# EAGLE design ISP_POGO_programmer (EAGLE 7.2.0)
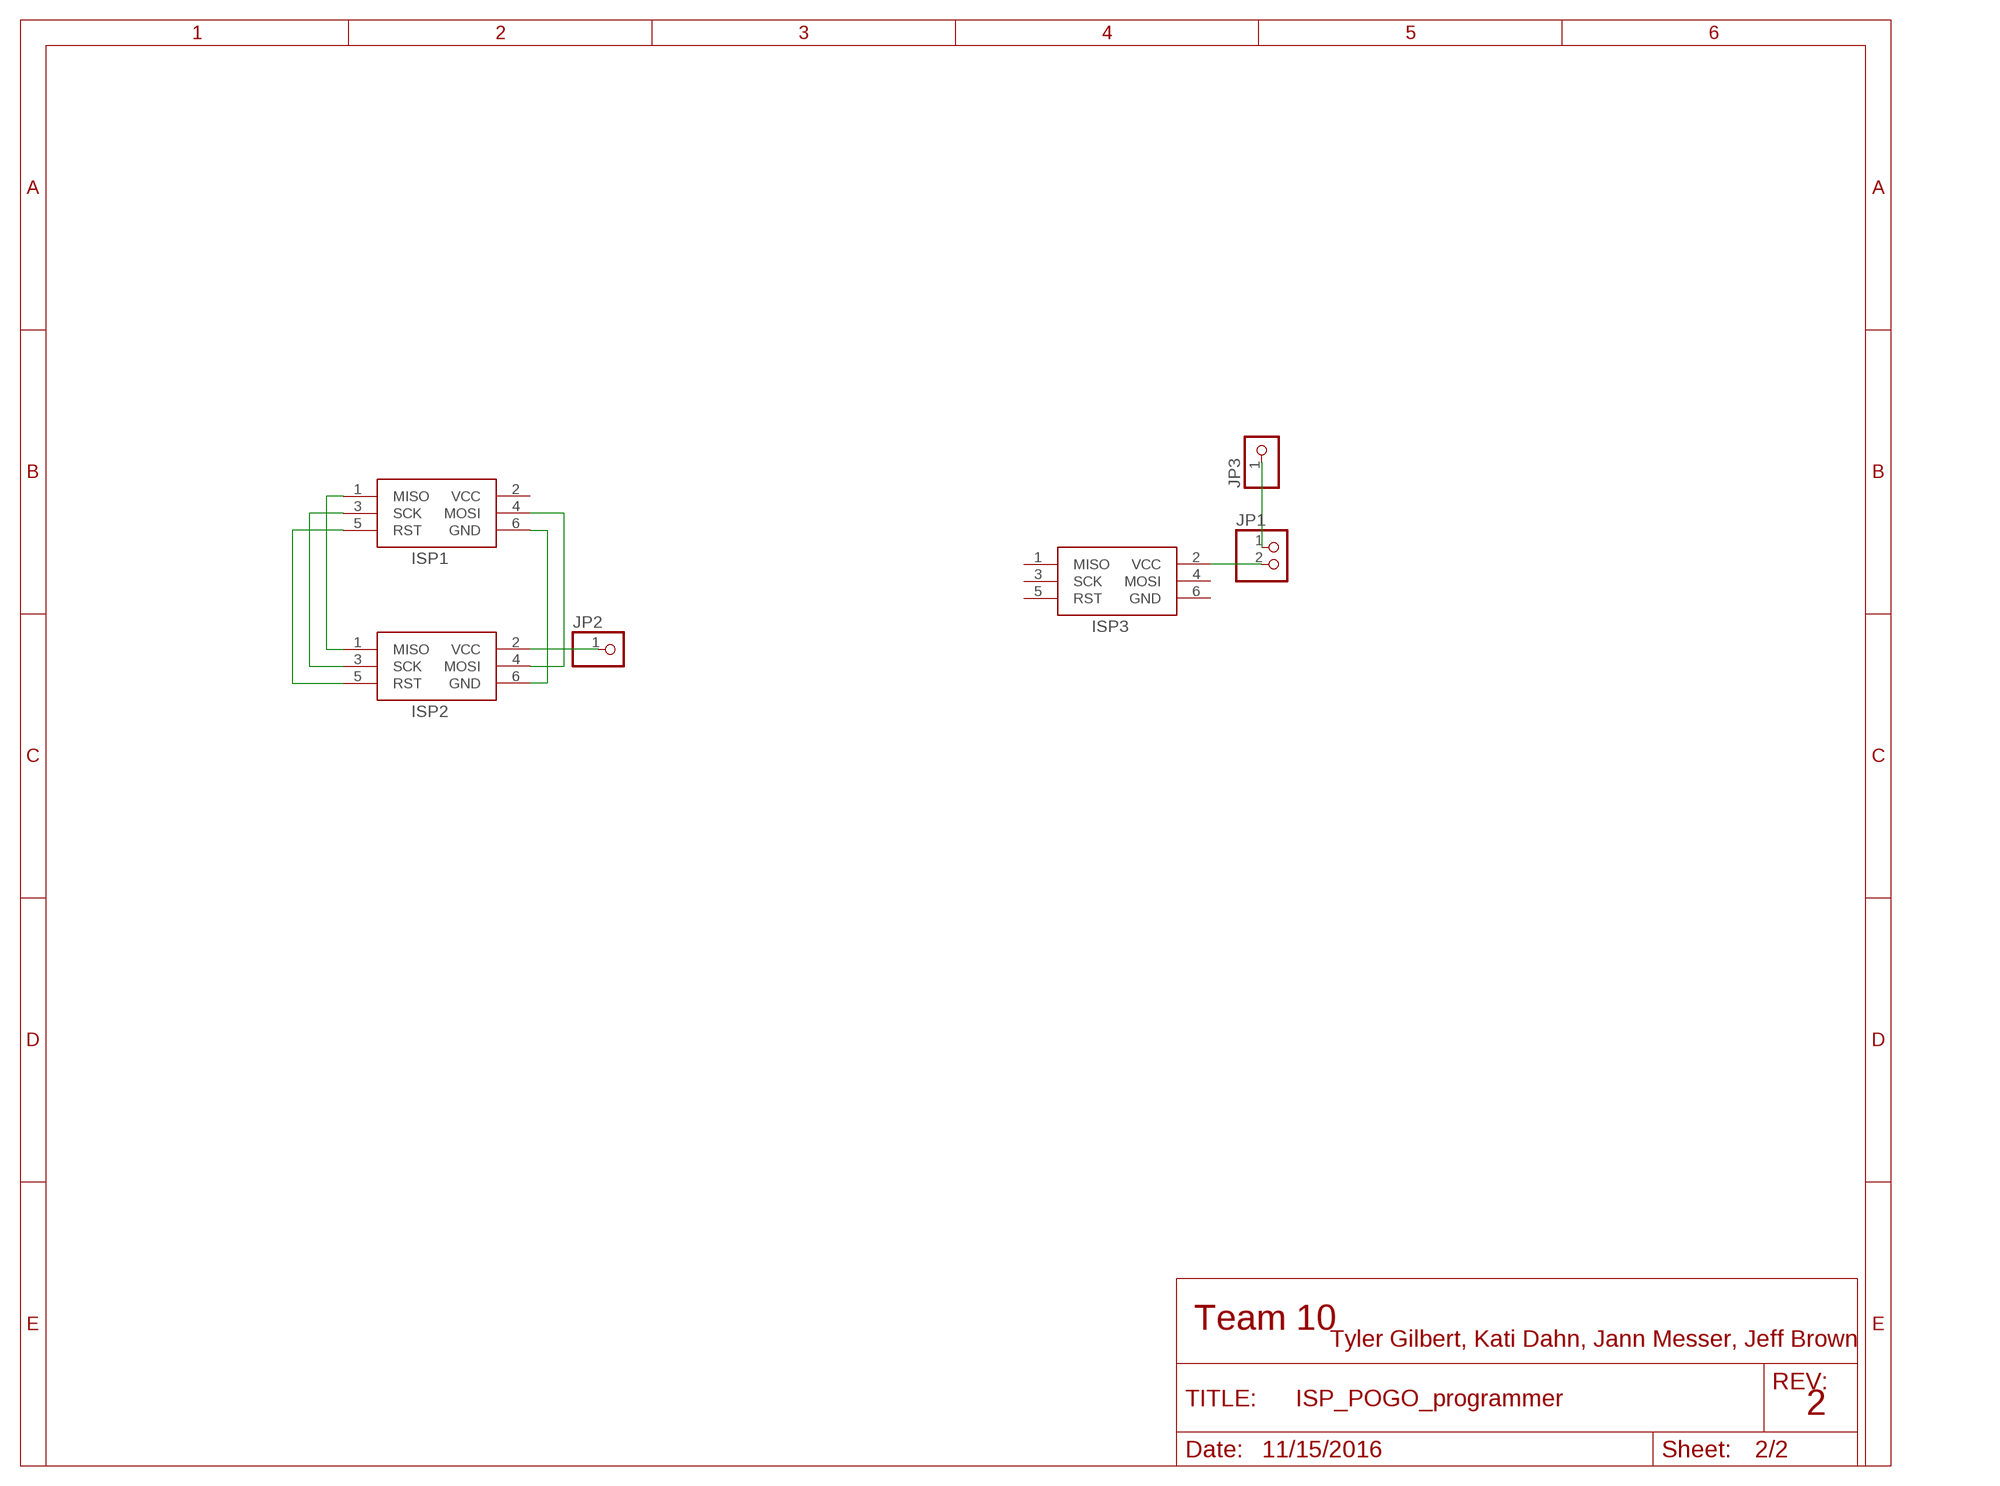
[diagram p0: schematic, sheet 1]

## Parts
ISP1  AVRISP-6  [AVRISP]
ISP2  AVRISP-6  [AVRISP]
ISP3  AVRISP-6  [AVRISP]
JP1  PINHD-1X2  [1X02]
JP2  PINHD-1X1  [1X01]
JP3  PINHD-1X1  [1X01]

## Nets
N$1: ISP1.1(MISO) ISP2.1(MISO)
N$2: ISP1.3(SCK) ISP2.3(SCK)
N$3: ISP1.5(RST) ISP2.5(RST)
N$4: ISP1.6(GND) ISP2.6(GND)
N$5: ISP1.4(MOSI) ISP2.4(MOSI)
N$6: ISP3.2(VCC) JP1.2
N$7: JP1.1 JP3.1
N$8: ISP2.2(VCC) JP2.1
Unconnected: ISP3.1(MISO) ISP3.3(SCK) ISP3.4(MOSI) ISP3.5(RST)

## Power pins joined to a net without a drawn wire
GND: ISP3.6(GND)
VCC: ISP1.2(VCC)

## Library data of the parts
ISP1-ISP3 = adafruit:AVRISP: AVR ISP HEADER Standard 6 pin header for AVR programming
JP1 = pinhead:PINHD-1X2: PIN HEADER
JP2 JP3 = pinhead:PINHD-1X1: PIN HEADER

## Board
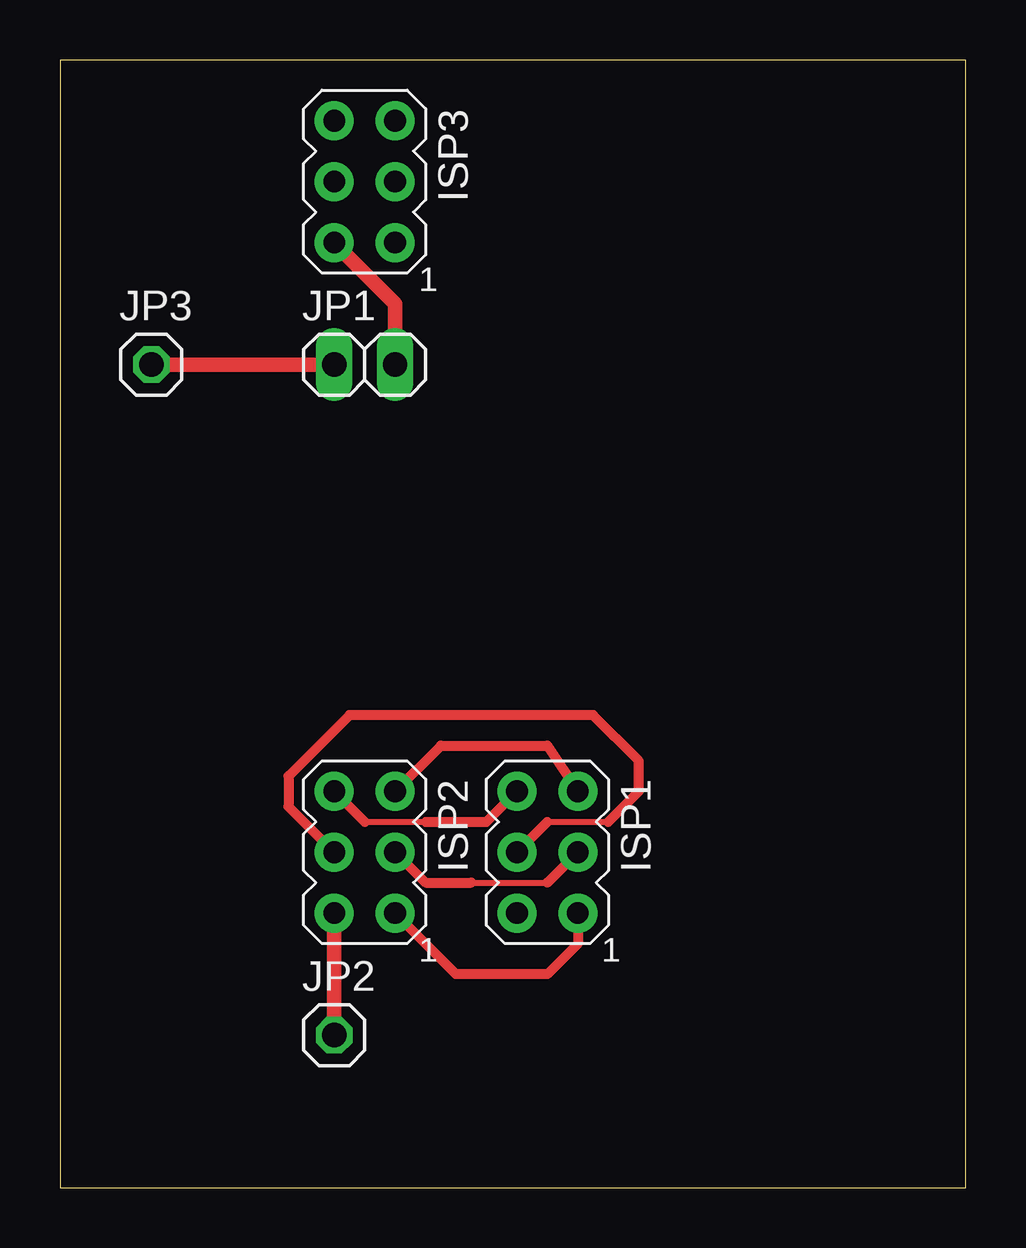
[diagram p1: board, top side]

Size 37.77 x 46.98 mm. Coordinates in mm from the lower left corner, seen from the top.
Outline: 0,0 37.77,0 37.77,46.98 0,46.98 0,0
Copper layers (1*16): Top 0.035mm / dielectric 1.5mm / Bottom 0.035mm
Design rules "default": minimum track width 10mil, minimum drill 24mil, track to track 8mil, track to pad 8mil, pad to pad 8mil, via to via 8mil, smd to smd 8mil, copper to edge 40mil, drill to drill 8mil, minimum pad ring 10mil, minimum via ring 8mil, stop-mask expansion 4mil, vias tented up to drill 0mil, thermal gap 10mil

### Footprints (pad centres in the part's own frame; a part is rotated, then mirrored left to right if it is on the bottom)
AVRISP = drill 0.9 pad 1.626: 1 -1.27,2.54; 2 1.27,2.54; 3 -1.27,0; 4 1.27,0; 5 -1.27,-2.54; 6 1.27,-2.54
1X02 = drill 1.016 long: 1 -1.27,0; 2 1.27,0
1X01 = drill 1.016 octagon: 1 0,0

### Placement (x,y rotation side)
ISP1  20.32,13.97 180 top
ISP2  12.7,13.97 180 top
ISP3  12.7,41.91 180 top
JP1  12.7,34.29 0 top
JP2  11.43,6.35 0 top
JP3  3.81,34.29 0 top

### Tracks (layer width: path | path; a pad name or v marks a point on that pad's centre or on a via)
N$1
  Top 0.406: ISP1.1 21.59,10.16 20.32,8.89 16.51,8.89 ISP2.1
N$2
  Top 0.254: 17.14,12.7 20.32,12.7
  Top 0.406: ISP2.3 15.24,12.7 17.14,12.7 | 20.32,12.7 ISP1.3
N$3
  Top 0.406: ISP2.5 15.88,18.41 20.32,18.41 ISP1.5
N$4
  Top 0.254: 12.7,15.24 15.24,15.24
  Top 0.406: ISP2.6 12.7,15.24 | 15.24,15.24 17.78,15.24 ISP1.6
N$5
  Top 0.254: 20.32,15.24 22.86,15.24
  Top 0.406: ISP1.4 20.32,15.24 | 22.86,15.24 24.13,16.51 24.13,17.78 22.23,19.68 12.06,19.68 9.53,17.14 9.53,15.88 ISP2.4
N$6
  Top 0.61: JP1.2 13.97,36.83 ISP3.2
N$7
  Top 0.61: JP1.1 JP3.1
N$8
  Top 0.61: ISP2.2 JP2.1